# Altium project ArtFire.PrjPcb
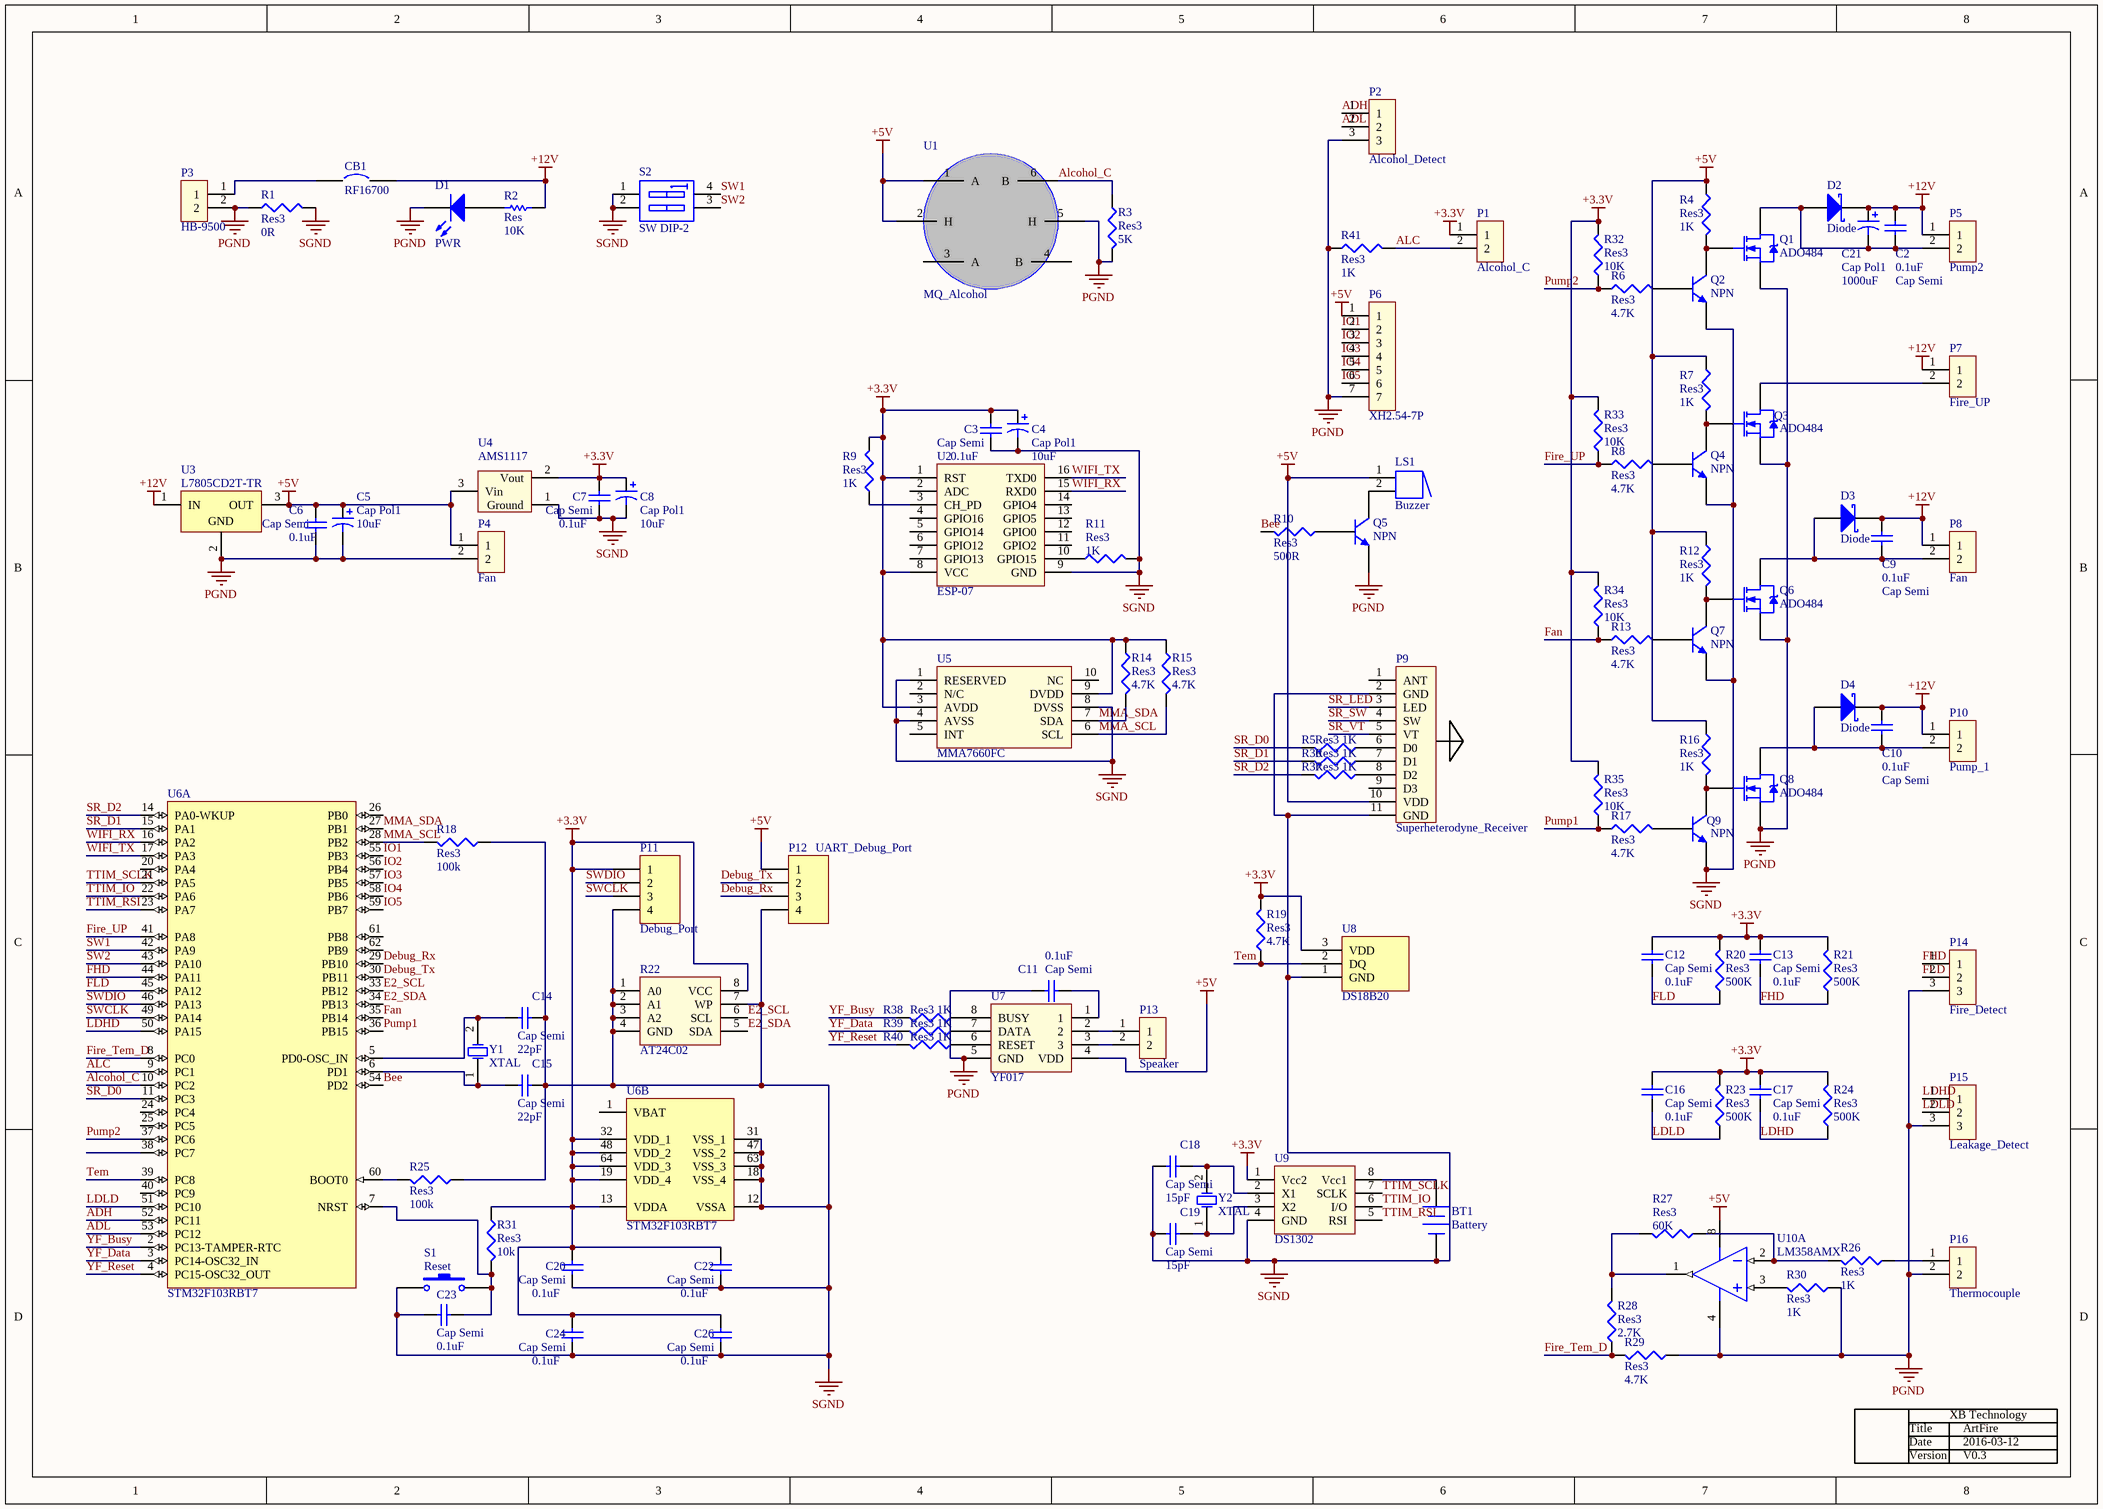
[diagram p0: ArtFire.SchDoc]
1 sheet, 111 parts. Net scope: global (net labels, ports and power ports of the same name join across sheets).
Board file: ArtFire.PcbDoc

## Sheet ArtFire.SchDoc: ArtFire
size A3; Date: 2016-03-12; Version: V0.3

### Parts
BT1  Battery  [Battery_1302]
C2  Cap Semi  value 0.1uF  [6-0805_N]
C3  Cap Semi  value 0.1uF  [6-0805_N]
C4  Cap Pol1  value 10uF  [Cap_5*4mm]
C5  Cap Pol1  value 10uF  [Cap_5*4mm]
C6  Cap Semi  value 0.1uF  [6-0805_N]
C7  Cap Semi  value 0.1uF  [6-0805_N]
C8  Cap Pol1  value 10uF  [Cap_5*4mm]
C9  Cap Semi  value 0.1uF  [6-0805_N]
C10  Cap Semi  value 0.1uF  [6-0805_N]
C11  Cap Semi  value 0.1uF  [6-0805_N]
C12  Cap Semi  value 0.1uF  [6-0805_N]
C13  Cap Semi  value 0.1uF  [6-0805_N]
C14  Cap Semi  value 22pF  [6-0805_N]
C15  Cap Semi  value 22pF  [6-0805_N]
C16  Cap Semi  value 0.1uF  [6-0805_N]
C17  Cap Semi  value 0.1uF  [6-0805_N]
C18  Cap Semi  value 15pF  [6-0805_N]
C19  Cap Semi  value 15pF  [6-0805_N]
C20  Cap Semi  value 0.1uF  [6-0805_N]
C21  Cap Pol1  value 1000uF  [CAP_10*10MM]
C22  Cap Semi  value 0.1uF  [6-0805_N]
C23  Cap Semi  value 0.1uF  [6-0805_N]
C24  Cap Semi  value 0.1uF  [6-0805_N]
C26  Cap Semi  value 0.1uF  [6-0805_N]
CB1  RF16700  [SPST-2]
D1  PWR  [6-0805_N]
D2  Diode  [US1M]
D3  Diode  [US1M]
D4  Diode  [US1M]
LS1  Buzzer  [BUZZER]
P1  Alcohol_C  [CH3.96_2P]
P2  Alcohol_Detect  [XH2.54-3P]
P3  HB-9500  [HB-9500]
P4  Fan  [XH2.54-2P]
P5  Pump2  [CH3.96_2P]
P6  XH2.54-7P  [XH2.54-7P]
P7  Fire_UP  [KF3.96_2P]
P8  Fan  [XH2.54-2P]
P9  Superheterodyne_Receiver  [Sperheterodyne_Receiver]
P10  Pump_1  [CH3.96_2P]
P11  Debug_Port  [HDR1X4]
P12  UART_Debug_Port  [HDR1X4]
P13  Speaker  [XH2.54-2P]
P14  Fire_Detect  [CH3.96_3P]
P15  Leakage_Detect  [XH2.54-3P]
P16  Thermocouple  [CH3.96_2P]
Q1  ADO484  [DPAK_AOD484]
Q2  NPN  [SOT-23_N]
Q3  ADO484  [DPAK_AOD484]
Q4  NPN  [SOT-23_N]
Q5  NPN  [SOT-23_N]
Q6  ADO484  [DPAK_AOD484]
Q7  NPN  [SOT-23_N]
Q8  ADO484  [DPAK_AOD484]
Q9  NPN  [SOT-23_N]
R1  Res3  value 0R  [6-0805_N]
R2  Res  value 10K  [6-0805_N]
R3  Res3  value 5K  [6-0805_N]
R4  Res3  value 1K  [6-0805_N]
R5  Res3  value 1K  [6-0805_N]
R6  Res3  value 4.7K  [6-0805_N]
R7  Res3  value 1K  [6-0805_N]
R8  Res3  value 4.7K  [6-0805_N]
R9  Res3  value 1K  [6-0805_N]
R10  Res3  value 500R  [6-0805_N]
R11  Res3  value 1K  [6-0805_N]
R12  Res3  value 1K  [6-0805_N]
R13  Res3  value 4.7K  [6-0805_N]
R14  Res3  value 4.7K  [6-0805_N]
R15  Res3  value 4.7K  [6-0805_N]
R16  Res3  value 1K  [6-0805_N]
R17  Res3  value 4.7K  [6-0805_N]
R18  Res3  value 100k  [6-0805_N]
R19  Res3  value 4.7K  [6-0805_N]
R20  Res3  value 500K  [6-0805_N]
R21  Res3  value 500K  [6-0805_N]
R22  AT24C02  [SOP8_TDA2822]
R23  Res3  value 500K  [6-0805_N]
R24  Res3  value 500K  [6-0805_N]
R25  Res3  value 100k  [6-0805_N]
R26  Res3  value 1K  [6-0805_N]
R27  Res3  value 60K  [6-0805_N]
R28  Res3  value 2.7K  [6-0805_N]
R29  Res3  value 4.7K  [6-0805_N]
R30  Res3  value 1K  [6-0805_N]
R31  Res3  value 10k  [6-0805_N]
R32  Res3  value 10K  [6-0805_N]
R33  Res3  value 10K  [6-0805_N]
R34  Res3  value 10K  [6-0805_N]
R35  Res3  value 10K  [6-0805_N]
R36  Res3  value 1K  [6-0805_N]
R37  Res3  value 1K  [6-0805_N]
R38  Res3  value 1K  [6-0805_N]
R39  Res3  value 1K  [6-0805_N]
R40  Res3  value 1K  [6-0805_N]
R41  Res3  value 1K  [6-0805_N]
S1  Reset  [SWP_PB_6.5mm]
S2  SW DIP-2  [DIP-4]
U1  MQ_Alcohol  [MQ]
U2  ESP-07  [ESP-07_Wifi]
U3  L7805CD2T-TR  [D2PAK_N]
U4  AMS1117  [SOT223_N]
U5  MMA7660FC  [DFN-10P]
U6  STM32F103RBT7  [LQFP64_L]  (parts A,B of 2)
U7  YF017  [DIP-8]
U8  DS18B20  [TO-92A]
U9  DS1302  [SOP8_TDA2822]
U10  LM358AMX  [M08A_M]  (part A of 2)
Y1  XTAL  [XTAL]
Y2  XTAL  [32.768Cystal]

### Nets
+3.3V: C3.1 C4.1 C7.1 C8.1 C12.2 C13.2 C16.2 C17.2 C20.1 C22.1 C24.1 C26.1 P1.1 P11.1 R9.2 R14.1 R15.1 R19.2 R20.2 R21.2 R22.8(VCC) R23.2 R24.2 R31.1 R32.2 R33.2 R34.2 R35.2 U2.1(RST) U2.8(VCC) U4.2(Vout) U5.3(AVDD) U5.9(DVDD) U6.13(VDDA) U6.19(VDD_4) U6.32(VDD_1) U6.48(VDD_2) U6.64(VDD_3) U8.3(VDD) U9.1(Vcc2)
+5V: C5.1 C6.1 LS1.1 P4.1 P6.1 P9.10(VDD) P12.1 R4.1 R7.1 R12.1 R16.1 U1.1(A) U1.2(H) U3.3(OUT) U4.3(Vin) U7.4(VDD) U10.8(V+)
+12V: C2.1 C9.1 C10.1 C21.1 CB1.2 D2.2(K) D3.2(K) D4.2(K) P5.1 P7.1 P8.1 P10.1 R2.2 U3.1(IN)
PGND: C5.2 C6.2 C11.1 D1.2(K) P2.3 P3.2 P4.2 P6.7 P14.3 P15.3 P16.2 Q1.3(S) Q3.3(S) Q5.2(E) Q6.3(S) Q8.3(S) R1.1 R3.2 R29.1 R30.1 R41.1 U1.5(H) U3.2(GND) U7.5(GND) U10.4(GND)
SGND: BT1.2(-) C3.2 C4.2 C7.2 C8.2 C14.2 C15.2 C18.1 C19.1 C20.2 C22.2 C23.1 C24.2 C26.2 P9.2(GND) P9.11(GND) P11.4 P12.4 Q2.2(E) Q4.2(E) Q7.2(E) Q9.2(E) R1.2 R11.2 R18.1 R22.1(A0) R22.2(A1) R22.3(A2) R22.4(GND) R22.7(WP) R25.1 S1.1 S2.1(A1) S2.2(A2) U2.9(GND) U4.1(Ground) U5.1(RESERVED) U5.4(AVSS) U5.8(DVSS) U6.12(VSSA) U6.18(VSS_4) U6.31(VSS_1) U6.47(VSS_2) U6.63(VSS_3) U8.1(GND) U9.4(GND)
ADH: P2.1 U6.52(PC11)
ADL: P2.2 U6.53(PC12)
ALC: P1.2 R41.2 U6.9(PC1)
Alcohol_C: R3.1 U1.6(B) U6.10(PC2)
Bee: R10.2 U6.54(PD2)
Debug_Rx: P12.3 U6.29(PB10)
Debug_Tx: P12.2 U6.30(PB11)
E2_SCL: R22.6(SCL) U6.33(PB12)
E2_SDA: R22.5(SDA) U6.34(PB13)
Fan: R13.1 R34.1 U6.35(PB14)
FHD: C13.1 P14.1 R21.1 U6.44(PA11)
Fire_Tem_D: R28.1 R29.2 U6.8(PC0)
Fire_UP: R8.1 R33.1 U6.41(PA8)
FLD: C12.1 P14.2 R20.1 U6.45(PA12)
IO1: P6.2 U6.55(PB3)
IO2: P6.3 U6.56(PB4)
IO3: P6.4 U6.57(PB5)
IO4: P6.5 U6.58(PB6)
IO5: P6.6 U6.59(PB7)
LDHD: C17.1 P15.1 R24.1 U6.50(PA15)
LDLD: C16.1 P15.2 R23.1 U6.51(PC10)
MMA_SCL: R15.2 R18.2 U5.6(SCL) U6.28(PB2)
MMA_SDA: R14.2 U5.7(SDA) U6.27(PB1)
Pump1: R17.1 R35.1 U6.36(PB15)
Pump2: R6.1 R32.1 U6.37(PC6)
SR_D0: R5.2 U6.11(PC3)
SR_D1: R36.2 U6.15(PA1)
SR_D2: R37.2 U6.14(PA0-WKUP)
SR_LED: P9.3(LED)
SR_SW: P9.4(SW)
SR_VT: P9.5(VT)
SW1: S2.4(B1) U6.42(PA9)
SW2: S2.3(B2) U6.43(PA10)
SWCLK: P11.3 U6.49(PA14)
SWDIO: P11.2 U6.46(PA13)
Tem: R19.1 U6.39(PC8) U8.2(DQ)
TTIM_IO: U6.22(PA6) U9.6(I/O)
TTIM_RSI: U6.23(PA7) U9.5(RSI)
TTIM_SCLK: U6.21(PA5) U9.7(SCLK)
WIFI_RX: U2.15(RXD0) U6.16(PA2)
WIFI_TX: U2.16(TXD0) U6.17(PA3)
YF_Busy: R38.2 U6.2(PC13-TAMPER-RTC)
YF_Data: R39.2 U6.3(PC14-OSC32_IN)
YF_Reset: R40.2 U6.4(PC15-OSC32_OUT)
NetBT1_1: BT1.1(+) U9.8(Vcc1)
NetC2_2: C2.2 C21.2 D2.1(A) P5.2 Q1.2(D)
NetC9_2: C9.2 D3.1(A) P8.2 Q6.2(D)
NetC10_2: C10.2 D4.1(A) P10.2 Q8.2(D)
NetC11_2: C11.2 U7.1
NetC14_1: C14.1 U6.5(PD0-OSC_IN) Y1.2(OSC2)
NetC15_1: C15.1 U6.6(PD1) Y1.1(OSC1)
NetC18_2: C18.2 U9.2(X1) Y2.2(OSC2)
NetC19_2: C19.2 U9.3(X2) Y2.1(OSC1)
NetC23_2: C23.2 R31.2 S1.2 U6.7(NRST)
NetCB1_1: CB1.1 P3.1
NetD1_1: D1.1(A) R2.1
NetLS1_2: LS1.2 Q5.3(C)
NetP7_2: P7.2 Q3.2(D)
NetP9_6: P9.6(D0) R5.1
NetP9_7: P9.7(D1) R36.1
NetP9_8: P9.8(D2) R37.1
NetP13_1: P13.1 U7.2
NetP13_2: P13.2 U7.3
NetP16_1: P16.1 R26.1
NetQ1_1: Q1.1(G) Q2.3(C) R4.2
NetQ2_1: Q2.1(B) R6.2
NetQ3_1: Q3.1(G) Q4.3(C) R7.2
NetQ4_1: Q4.1(B) R8.2
NetQ5_1: Q5.1(B) R10.1
NetQ6_1: Q6.1(G) Q7.3(C) R12.2
NetQ7_1: Q7.1(B) R13.2
NetQ8_1: Q8.1(G) Q9.3(C) R16.2
NetQ9_1: Q9.1(B) R17.2
NetR9_1: R9.1 U2.3(CH_PD)
NetR11_1: R11.1 U2.10(GPIO15)
NetR25_2: R25.2 U6.60(BOOT0)
NetR26_2: R26.2 R27.1 U10.2(INA-)
NetR27_2: R27.2 R28.2 U10.1(OUTA)
NetR30_2: R30.2 U10.3(INA+)
NetR38_1: R38.1 U7.8(BUSY)
NetR39_1: R39.1 U7.7(DATA)
NetR40_1: R40.1 U7.6(RESET)

Not connected (* = marked no-connect by the designer): P9 1(ANT) 9(D3); U1 3(A) 4(B); U2 2(ADC) 4(GPIO16) 5(GPIO14) 6(GPIO12) 7(GPIO13) 11(GPIO2) 12(GPIO0) 13(GPIO5) 14(GPIO4); U5 2(N/C) 5(INT) 10(NC); U6 1(VBAT) 20(PA4) 24(PC4) 25(PC5) 26(PB0) 38(PC7) 40(PC9) 61(PB8) 62(PB9)

### Notes on the sheet
- Title
- Date
- Version
- XB Technology

### Library data of the parts
BT1 = Battery: Multicell Battery; Published: 24-Mar-1999; LatestRevisionDate: 17-Jul-2002; LatestRevisionNote: Re-released for DXP Platform.; PackageReference: BAT-2; Publisher: Altium Limited; PackageDescription: Battery; 2 Leads
C2 C3 C6 C7 C9-C20 C22-C24 C26 = Cap Semi: Capacitor (Semiconductor SIM Model); Published: 8-Jun-2000; LatestRevisionDate: 29-May-2009; LatestRevisionNote: IPC-7351 Footprint Added.; PackageReference: C1206; Publisher: Altium Limited; PackageDescription: Chip Capacitor
C4 C5 C8 C21 = Cap Pol1: Polarized Capacitor (Radial); Published: 8-Jun-2000; LatestRevisionDate: 17-Jul-2002; LatestRevisionNote: Re-released for DXP Platform.; PackageReference: RB7.6-15; Publisher: Altium Limited; PackageDescription: Polarized Capacitor (Radial); 2 Leads
CB1 = Circuit Breaker: Published: 24-Mar-1999; LatestRevisionDate: 17-Jul-2002; LatestRevisionNote: Re-released for DXP Platform.; PackageReference: SPST-2; Publisher: Altium Limited; PackageDescription: Switch; 2 Leads
D1 = LED0: Typical INFRARED GaAs LED; Published: 8-Jun-2000; LatestRevisionDate: 08-Jul-2005; LatestRevisionNote: Mech Layer 1 removed.; PackageReference: LED-0; Publisher: Altium Limited; PackageDescription: LED; 2 Leads
D2-D4 = Diode BAT17: Silicon RF Schottky Diode for Mixer Applications in the VHF/UHF Range; Note: Pin 2 is not connected and not drawn.; Published: 21-Mar-2003; LatestRevisionDate: 29-May-2009; LatestRevisionNote: IPC-7351 Footprint Added.; DatasheetVersion: Oct-1999; PackageVersion: Sep-2001; PackageReference: SOT-23; Publisher: Altium Limited; PackageDescription: 3-Pin SOT-23 Package 0.95 mm Pitch, 2.5 mm Lead Span; ComponentLink1Description: Manufacturer Link; ComponentLink1URL: http://www.infineon.com/; ComponentLink2Description: Datasheet; ComponentLink2URL: http://www.infineon.com/upload/Document/cmc_upload/documents/009/363/bat17series.pdf
LS1 = Buzzer: Magnetic Transducer Buzzer; Published: 24-Mar-1999; LatestRevisionDate: 17-Dec-2003; LatestRevisionNote: Schematic revised, PCB Footprint replaced.; DatasheetVersion: 17-Dec-2003; PackageReference: ABSM-1574; Publisher: Altium Limited; PackageDescription: Magnetic Transducer Buzzer; ComponentLink1Description: Manufacturer Link; ComponentLink1URL: http://www.megastar.com/linecard/buzzmode/index.php
P1 P5 P10 P16 = CH3.96_2P
P2 P15 = XH2.54-3P
P3 = HB-9500: High current connector
P4 P8 P13 = XH2.54-2P
P7 = KF3.96
P11 P12 = Header 4: Header, 4-Pin; LatestRevisionDate: 17-Jul-2002; LatestRevisionNote: Re-released for DXP Platform.; Publisher: Altium Limited
P14 = CH3.96_3P
Q1 Q3 Q6 Q8 = NMOS-2: N-Channel Power MOSFET; Note: Pin 2 is electrically connected to pin 4.; Published: 8-Jun-2000; LatestRevisionDate: 17-Jul-2002; LatestRevisionNote: Re-released for DXP Platform.; DatasheetVersion: PD-9.814; PackageVersion: Feb-1997; PackageReference: TO-220AB; Publisher: Altium Limited; PackageDescription: TO, Thru-Hole, Vertical, Heatsink Mounted; 3 In-Line Leads; Pitch 2.54 mm; ComponentLink1Description: Manufacturer Link; ComponentLink1URL: http://www.irf.com/
Q2 Q4 Q5 Q7 Q9 = NPN: NPN Bipolar Transistor; Published: 8-Jun-2000; LatestRevisionDate: 17-Jul-2002; LatestRevisionNote: Re-released for DXP Platform.; PackageReference: TO-226-AA; Publisher: Altium Limited; PackageDescription: TO, Flat Index; 3 In-Line, Axial Leads; Body Dia. 4.8mm; Leads 0.55 x 0.51 mm (max); Code_JEDEC: TO-226-AA
R1 R3-R21 R23-R41 = Res3: Resistor; Published: 8-Jun-2000; LatestRevisionDate: 29-May-2009; LatestRevisionNote: IPC-7351 Footprint Added.; PackageReference: J1-0603; Publisher: Altium Limited; PackageDescription: Chip Resistor
R2 = Res1: Resistor; Published: 8-Jun-2000; LatestRevisionDate: 17-Jul-2002; LatestRevisionNote: Re-released for DXP Platform.; PackageReference: AXIAL-0.3; Publisher: Altium Limited; PackageDescription: Axial Device, Thru-Hole; 2 Leads; 0.3 in Pin Spacing
S1 = SW-PB: Switch; Published: 24-Mar-1999; LatestRevisionDate: 17-Jul-2002; LatestRevisionNote: Re-released for DXP Platform.; PackageReference: SPST-2; Publisher: Altium Limited; PackageDescription: Switch; 2 Leads
S2 = SW DIP-2: DIP Switch, 2 Position, SPST; Published: 24-Mar-1999; LatestRevisionDate: 17-Jul-2002; LatestRevisionNote: Re-released for DXP Platform.; PackageReference: DIP-4; Publisher: Altium Limited
U1 = MQ
U2 = ESP-07_Wifi
U3 = CMP-0244-00485-1: Positive Voltage Regulator, 5V, 3-Pin TO-220; ComponentLink1URL: http://www.st.com; PackageDescription: TO, Thru-Hole, Vertical, Heatsink Mounted; 3 In-Line Leads; Pitch 2.54 mm; DatasheetVersion: 16/11/2011; ComponentLink2Description: Datasheet; ComponentLink1Description: Manufacturer URL; PackageReference: TO220; ComponentLink3Description: Package Specification; ComponentLink2URL: http://www.st.com/internet/com/TECHNICAL_RESOURCES/TECHNICAL_LITERATURE/DATASHEET/CD00000444.pdf; ComponentLink3URL: http://www.st.com/internet/com/TECHNICAL_RESOURCES/TECHNICAL_LITERATURE/PACKAGE_INFORMATION/CD00004649.pdf; PackageVersion: ver3.0
U6 = CMP-0237-00161-1: STM32 ARM-based 32-bit MCU Performance Line with 128 kB Flash, 20 kB Internal RAM, -40 to +105°C Temperature, 64-Pin LQFP, Tray; ComponentLink2Description: STM32 Family Web Page; ComponentLink1URL: http://www.st.com/internet/com/TECHNICAL_RESOURCES/TECHNICAL_LITERATURE/DATASHEET/CD00161566.pdf; ComponentLink3URL: http://www.st.com/internet/com/home/home.jsp; ComponentLink1Description: STM32F103 Datasheet; PackageVersion: rev13, Apr-2011; ComponentLink2URL: www.st.com/stm32; ComponentLink3Description: st.com Home; PackageDescription: 64-Pin Low-Profile Quad Flat Pack, 10 x 10 mm Body, 0.5 mm Pitch (LQFP64); DatasheetVersion: rev13.0, Apr-2011; PackageReference: LQFP64
U10 = CMP-0055-00768-2: Low Power Dual Operational Amplifier, 8-pin Narrow SOIC; Manufacturer: National Semiconductor; PowerWise: N; PackageTopMarking: NSZXTT*LM*358AM; CompType: Amplifiers; ComponentLink2Description: LM358 Web Page; ComponentLink3Description: M08A Package Page; ComponentLink1Description: LM358 Datasheet; PackageReference: M08A; ComponentLink2URL: http://www.national.com/pf/LM/LM358.html; ComponentLink3URL: http://www.national.com/packaging/folders/m08a.html; PackageDescription: SOIC Narrow, 4.9 x 3.9 x 1.45mm, 8 Lead, 1.27mm Pitch; PinCount: 8; DatasheetVersion: Oct-2005; ComponentLink1URL: http://www.national.com/ds/LM/LM358.pdf; RevisionNote: Component URLs added; RoHS: N; Code_JEDEC: MS-012-AA; PackageVersion: revM, May-2009; Code_IPC: SOIC127P600-8
Y1 Y2 = XTAL: Crystal Oscillator; Published: 8-Jun-2000; LatestRevisionDate: 17-Jul-2002; LatestRevisionNote: Re-released for DXP Platform.; PackageReference: R38; Publisher: Altium Limited; PackageDescription: Crystal, Thru-Hole; 2 Leads; Body 3.1 x 8.2 mm (Dia.xH)